# EAGLE schematic arduino-scratch (EAGLE 9.6.2)
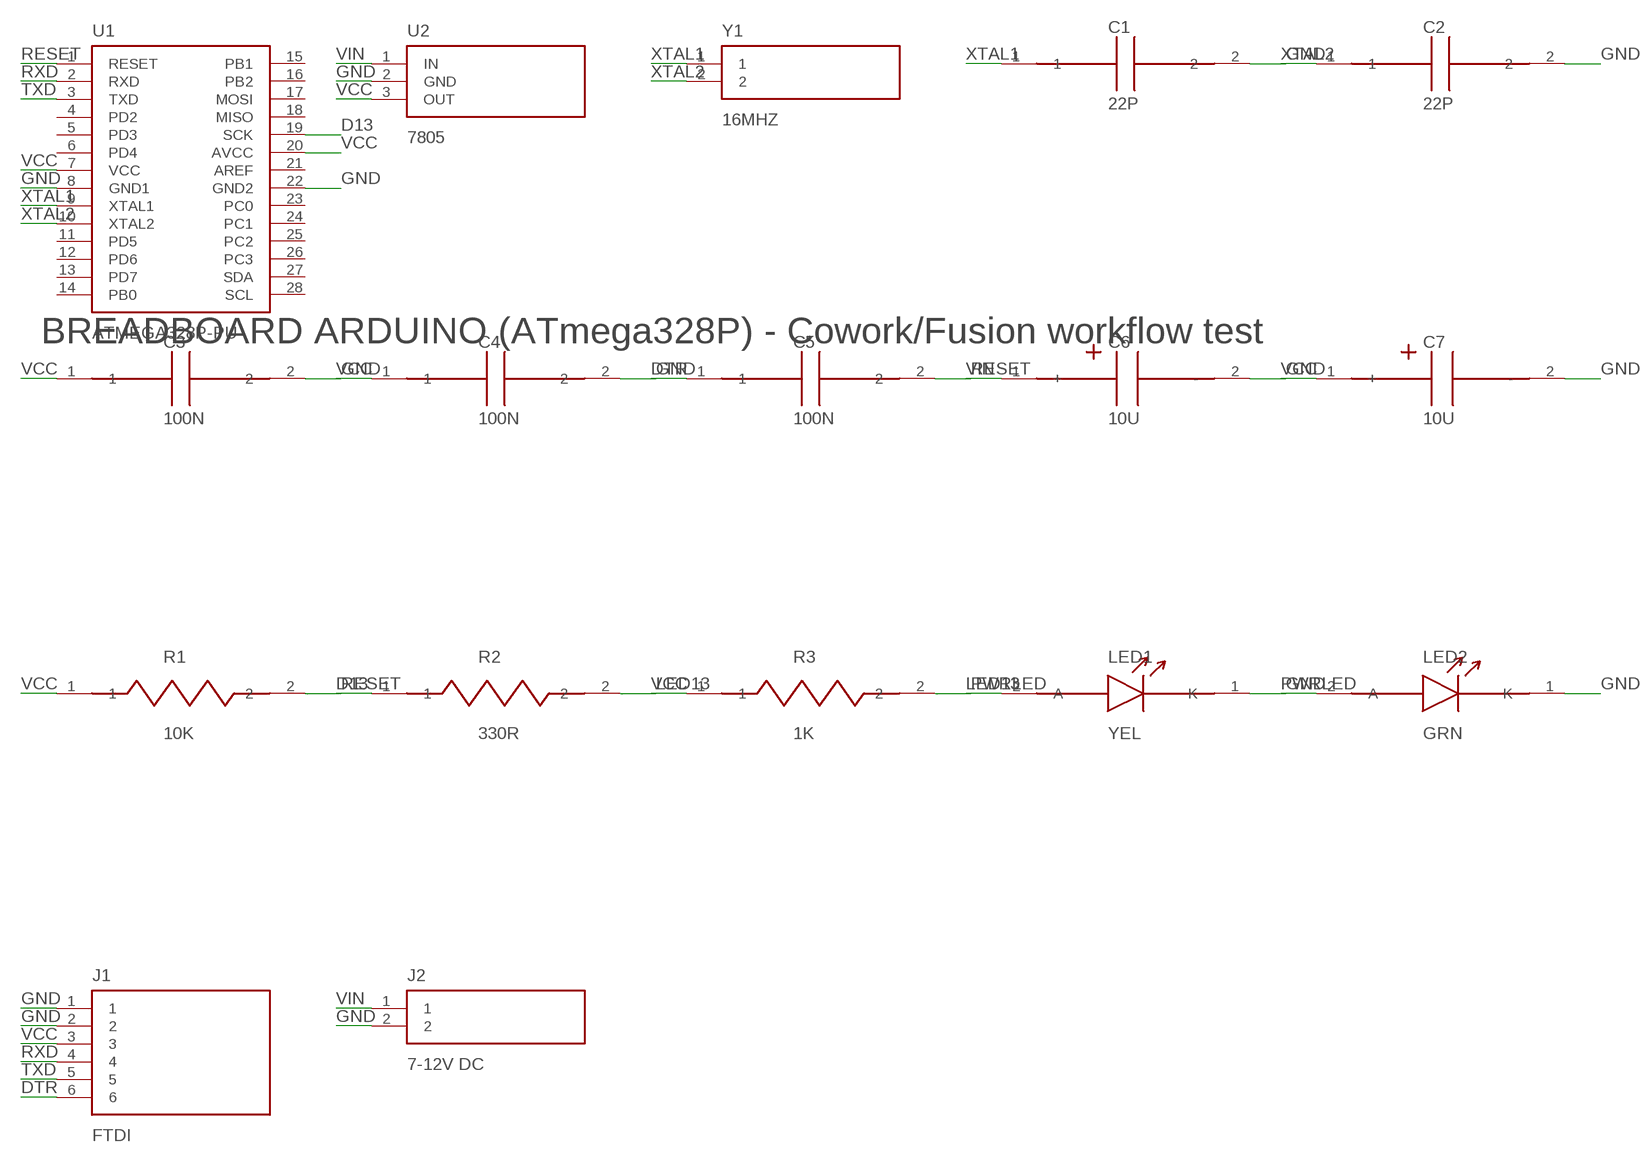
[diagram p0: schematic, sheet 1]

## Parts
C1  22P  CAP  [C_DISC]
C2  22P  CAP  [C_DISC]
C3  100N  CAP  [C_DISC]
C4  100N  CAP  [C_DISC]
C5  100N  CAP  [C_DISC]
C6  10U  CAPP  [CP_RADIAL]
C7  10U  CAPP  [CP_RADIAL]
J1  FTDI  HDR6  [HDR6]
J2  7-12V DC  HDR2  [HDR2]
LED1  YEL  LED  [LED5]
LED2  GRN  LED  [LED5]
R1  10K  RES  [R_AXIAL]
R2  330R  RES  [R_AXIAL]
R3  1K  RES  [R_AXIAL]
U1  ATMEGA328P-PU  ATMEGA328  [DIP28N]
U2  7805  L7805  [TO220]
Y1  16MHZ  XTAL16  [HC49]

## Nets
D13: R2.1 U1.19(SCK)
DTR: C5.1 J1.6
GND: C1.2 C2.2 C3.2 C4.2 C6.2(-) C7.2(-) J1.1 J1.2 J2.2 LED1.1(K) LED2.1(K) U1.8(GND1) U1.22(GND2) U2.2(GND)
LED13: LED1.2(A) R2.2
PWRLED: LED2.2(A) R3.2
RESET: C5.2 R1.2 U1.1(RESET)
RXD: J1.4 U1.2(RXD)
TXD: J1.5 U1.3(TXD)
VCC: C3.1 C4.1 C7.1(+) J1.3 R1.1 R3.1 U1.7(VCC) U1.20(AVCC) U2.3(OUT)
VIN: C6.1(+) J2.1 U2.1(IN)
XTAL1: C1.1 U1.9(XTAL1) Y1.1
XTAL2: C2.1 U1.10(XTAL2) Y1.2
Unconnected: U1.4(PD2) U1.5(PD3) U1.6(PD4) U1.11(PD5) U1.12(PD6) U1.13(PD7) U1.14(PB0) U1.15(PB1) U1.16(PB2) U1.17(MOSI) U1.18(MISO) U1.21(AREF) U1.23(PC0) U1.24(PC1) U1.25(PC2) U1.26(PC3) U1.27(SDA) U1.28(SCL)

## Notes on the sheet
- BREADBOARD ARDUINO (ATmega328P) - Cowork/Fusion workflow test

## Library data of the parts
C1-C5 = p8x:CAP
C6 C7 = p8x:CAPP
J1 = p8x:HDR6
J2 = p8x:HDR2
LED1 LED2 = p8x:LED
R1-R3 = p8x:RES
U1 = p8x:ATMEGA328
U2 = p8x:L7805
Y1 = p8x:XTAL16